# Altium schematic sheet Led7_74HC595.SchDoc
size A
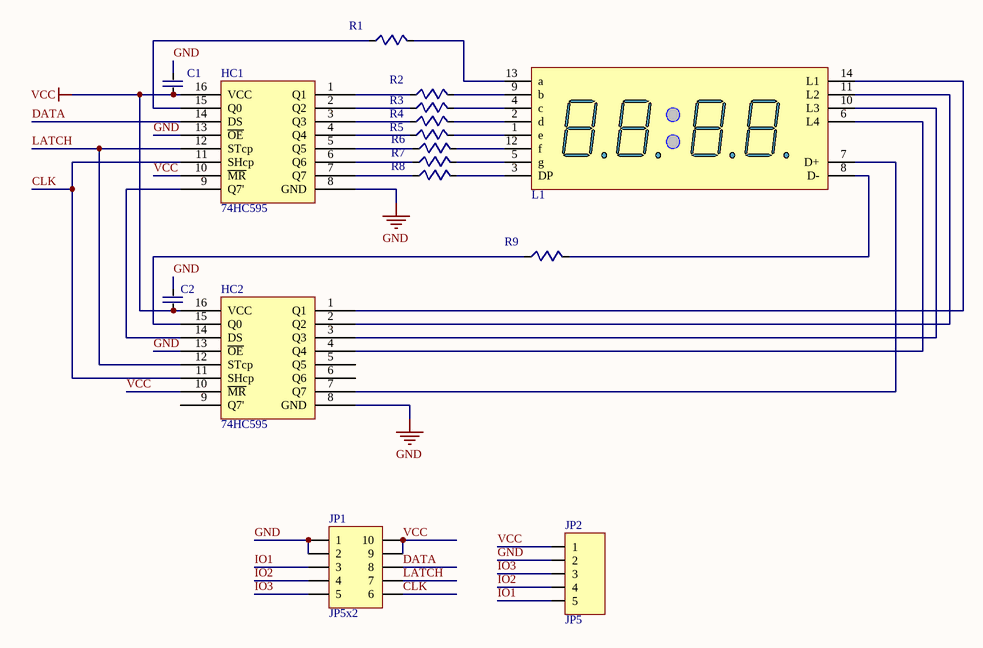
[diagram p0: Led7_74HC595.SchDoc]

## Parts
C1  100n Cer  [CAPC_0805]  (value not drawn)
C2  100n Cer  [CAPC_0805]  (value not drawn)
HC1  74HC595  [SOIC_16]
HC2  74HC595  [SOIC_16]
JP1  JP5x2  [JP5-D2T]
JP2  JP5  [JP5-C1T]
L1  Led 7 Seg 4 digit - Anode  [LED7SEG-4-0.56-RG]  (value not drawn)
R1  RC0805FR-07100RL  [RESC_0805]  (value not drawn)
R2  RC0805FR-07100RL  [RESC_0805]  (value not drawn)
R3  RC0805FR-07100RL  [RESC_0805]  (value not drawn)
R4  RC0805FR-07100RL  [RESC_0805]  (value not drawn)
R5  RC0805FR-07100RL  [RESC_0805]  (value not drawn)
R6  RC0805FR-07100RL  [RESC_0805]  (value not drawn)
R7  RC0805FR-07100RL  [RESC_0805]  (value not drawn)
R8  RC0805FR-07100RL  [RESC_0805]  (value not drawn)
R9  RC0805FR-07100RL  [RESC_0805]  (value not drawn)

## Nets
GND: C1.2 C2.2 HC1.8(GND) HC1.13(~{OE}) HC2.8(GND) HC2.13(~{OE}) JP1.1 JP1.2 JP2.2
VCC: C1.1 C2.1 HC1.10(~{MR}) HC1.16(VCC) HC2.10(~{MR}) HC2.16(VCC) JP1.9 JP1.10 JP2.1
CLK: HC1.11(SHcp) HC2.11(SHcp) JP1.6
DATA: HC1.14(DS) JP1.8
IO1: JP1.3 JP2.5
IO2: JP1.4 JP2.4
IO3: JP1.5 JP2.3
LATCH: HC1.12(STcp) HC2.12(STcp) JP1.7
NetHC1_1: HC1.1(Q1) R2.1
NetHC1_2: HC1.2(Q2) R3.1
NetHC1_3: HC1.3(Q3) R4.1
NetHC1_4: HC1.4(Q4) R5.1
NetHC1_5: HC1.5(Q5) R6.1
NetHC1_6: HC1.6(Q6) R7.1
NetHC1_7: HC1.7(Q7) R8.1
NetHC1_9: HC1.9(Q7') HC2.14(DS)
NetHC1_15: HC1.15(Q0) R1.1
NetHC2_1: HC2.1(Q1) L1.14(L1)
NetHC2_2: HC2.2(Q2) L1.11(L2)
NetHC2_3: HC2.3(Q3) L1.10(L3)
NetHC2_4: HC2.4(Q4) L1.6(L4)
NetHC2_7: HC2.7(Q7) L1.7(D+)
NetHC2_15: HC2.15(Q0) R9.1
NetL1_1: L1.1(e) R5.2
NetL1_2: L1.2(d) R4.2
NetL1_3: L1.3(DP) R8.2
NetL1_4: L1.4(c) R3.2
NetL1_5: L1.5(g) R7.2
NetL1_8: L1.8(D-) R9.2
NetL1_9: L1.9(b) R2.2
NetL1_12: L1.12(f) R6.2
NetL1_13: L1.13(a) R1.2

Not connected (* = marked no-connect by the designer): HC2 5(Q5) 6(Q6) 9(Q7')

## Library data of the parts
C1 C2 = CAPC0805_104: CAP CER 0.1UF 25V 10% X7R 0805; Supplier 1: Digi-Key; Supplier Part Number 1: 399-1168-2-ND
JP1 = JP5x2: WR-PHD 2.54 mm Dual Socket Header; Manufacturer: W¨¹rth Elektronik eiSos GmbH; partNo: 61301021821; ComponentLink1 Description: Manufacturer; ComponentLink2 Description: Datasheet; NoPins: 10; Created Date: 29 March 2013; ComponentLink1URL: http://www.we-online.com; ComponentLink2URL: http://katalog.we-online.de/em/datasheet/6130xx21821.pdf; Created by: Karrer Zheng
JP2 = JP5: WR-PHD 2.54 mm Angled Socket Header; Manufacturer: W¨¹rth Elektronik eiSos GmbH; partNo: 613005143121; ComponentLink1 Description: Manufacturer; ComponentLink2 Description: Datasheet; NoPins: 05; Created Date: 29 March 2013; ComponentLink1URL: http://www.we-online.com; ComponentLink2URL: http://katalog.we-online.de/em/datasheet/6130xx143121.pdf; Created by: Karrer Zheng
L1 = LED7SEG-4-RG
R1-R9 = RES0805_100R: RES SMD 100 OHM 1% 1/8W 0805; Supplier 1: Digi-Key